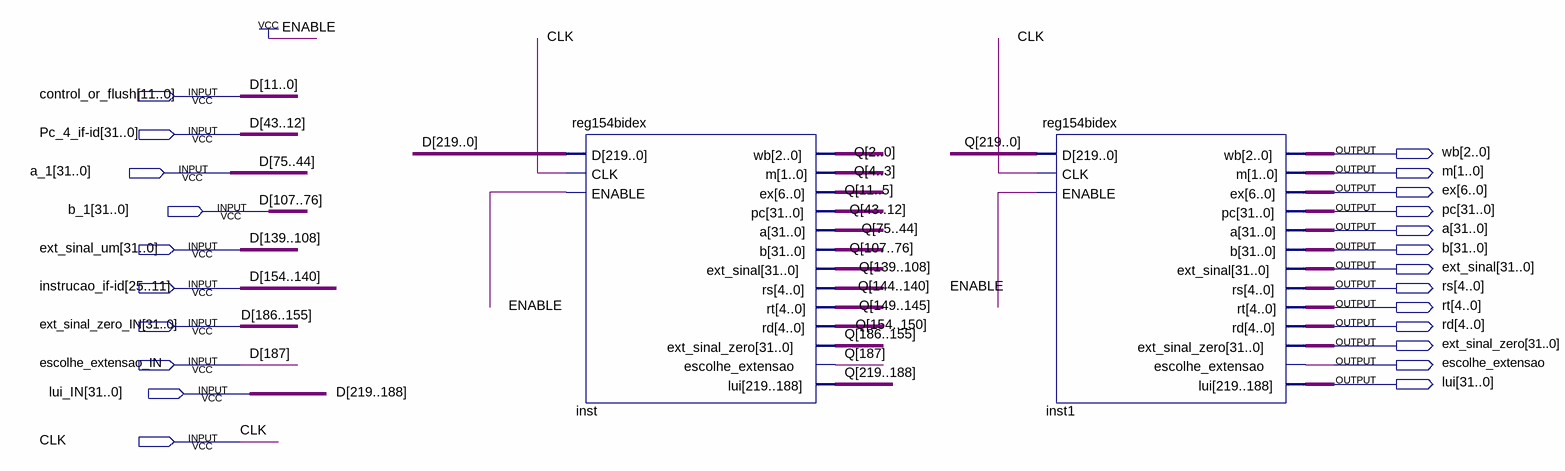
[diagram p0: schematic sheet]
// Quartus schematic ID-EX.bdf as structural Verilog: 2 symbols, 23 pins
module \ID-EX  (
  input  [11:0] control_or_flush,
  input  [31:0] \Pc_4_if-id ,
  input  [31:0] a_1,
  input  [31:0] b_1,
  input  [31:0] ext_sinal_um,
  input  [25:11] \instrucao_if-id ,
  input  [31:0] ext_sinal_zero_IN,
  input  escolhe_extensao_IN,
  input  [31:0] lui_IN,
  input  CLK,
  output [2:0] wb,
  output [1:0] m,
  output [6:0] ex,
  output [31:0] pc,
  output [31:0] a,
  output [31:0] b,
  output [31:0] ext_sinal,
  output [4:0] rs,
  output [4:0] rt,
  output [4:0] rd,
  output [31:0] ext_sinal_zero,
  output escolhe_extensao,
  output [31:0] lui
);

  wire [219:0] Q;

  reg154bidex inst (
    .D({lui_IN, escolhe_extensao_IN, ext_sinal_zero_IN, \instrucao_if-id , ext_sinal_um, b_1, a_1, \Pc_4_if-id , control_or_flush}),
    .CLK(CLK), .ENABLE(1'b1), .wb(Q[2:0]), .m(Q[4:3]), .ex(Q[11:5]), .pc(Q[43:12]), .a(Q[75:44]),
    .b(Q[107:76]), .ext_sinal(Q[139:108]), .rs(Q[144:140]), .rt(Q[149:145]), .rd(Q[154:150]),
    .ext_sinal_zero(Q[186:155]), .escolhe_extensao(Q[187]), .lui(Q[219:188]));
  reg154bidex inst1 (
    .D(Q), .CLK(CLK), .ENABLE(1'b1), .wb(wb), .m(m), .ex(ex), .pc(pc), .a(a), .b(b), .ext_sinal(ext_sinal),
    .rs(rs), .rt(rt), .rd(rd), .ext_sinal_zero(ext_sinal_zero), .escolhe_extensao(escolhe_extensao), .lui(lui));

  // Other names for the same wires on the sheet: D[219:0] = {lui_IN, escolhe_extensao_IN, ext_sinal_zero_IN, \instrucao_if-id , ext_sinal_um, b_1, a_1, \Pc_4_if-id , control_or_flush}
endmodule
